# EAGLE schematic g29_load_cell (EAGLE 9.5.2)
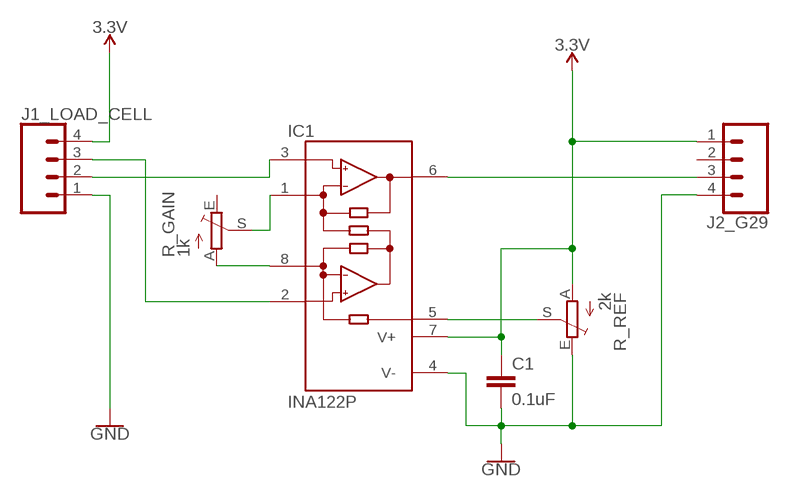
[diagram p0: schematic, sheet 1]

## Parts
C1  0.1uF  C-EU025-024X044  [C025-024X044]
IC1  INA122P  [DIL08]
J1_LOAD_CELL  CONN_04SCREW  [SCREWTERMINAL-3.5MM-4]
J2_G29  CONN_04SCREW  [SCREWTERMINAL-3.5MM-4]
R_GAIN  1k  TRIM_EU-RJ9W  [RJ9W]
R_REF  2k  TRIM_EU-RJ9W  [RJ9W]

## Nets
3.3V: C1.1 IC1.7(V+) J1_LOAD_CELL.4 J2_G29.1 R_REF.A
GND: C1.2 IC1.4(V-) J1_LOAD_CELL.1 J2_G29.4 R_REF.E
N$1: IC1.8(RG) R_GAIN.A
N$2: IC1.1(RG) R_GAIN.S
N$3: IC1.3(+IN) J1_LOAD_CELL.2
N$4: IC1.2(-IN) J1_LOAD_CELL.3
N$6: IC1.5(REF) R_REF.S
N$7: IC1.6(OUT) J2_G29.3
Unconnected: J2_G29.2 R_GAIN.E

## Library data of the parts
C1 = rcl:C-EU: CAPACITOR, European symbol; SPICEPREFIX: C
IC1 = burr-brown:INA122: Instrumentation Amplifier Single Supply, MicroPower; MF: TEXAS INSTRUMENTS; MPN: INA122P; OC_FARNELL: 1459460; OC_NEWARK: 15M0948
J1_LOAD_CELL J2_G29 = SparkFun-Connectors:CONN_04: Multi connection point. Often used as Generic Header-pin footprint for 0.1 inch spaced/style header connections On any of the 0.1 inch spaced packages, you can populate with these: Break Away Headers - Straight <https://www.sparkfun.com/products/116> (PRT-00116) Break Away Male Headers - Right Angle <https://www.sparkfun.com/products/553> (PRT-00553) Female Headers <https://www.sparkfun.com/products/115> (PRT-00115) Break Away Headers - Machine Pin <https://www.sparkfun.com/products/117> (PRT-00117) Break Away Female Headers - Swiss Machine Pin <https://www.sparkfun.com/products/743> (PRT-00743) For SCREWTERMINALS and SPRING TERMINALS visit here: Screw Terimnals on SparkFun.com <https://www.sparkfun.com/search/results?term=Screw+Terminals> (5mm/3.5mm/2.54mm spacing) This device is also useful as a general connection point to wire up your design to another part of your project. Our various solder wires solder well into these plated through hole pads. Hook-Up Wire - Assortment (Stranded, 22 AWG) <https://www.sparkfun.com/products/11375> (PRT-11375) Hook-Up Wire - Assortment (Solid Core, 22 AWG) <https://www.sparkfun.com/products/11367> (PRT-11367) View the entire wire category on our website here <https://www.sparkfun.com/categories/141> Special notes: Molex polarized connector foot print use with SKU : PRT-08231 with associated crimp pins and housings. 1MM SMD Version SKU: PRT-10208; PROD_ID: CONN-14485
R_GAIN R_REF = pot:TRIM_EU-: POTENTIOMETER